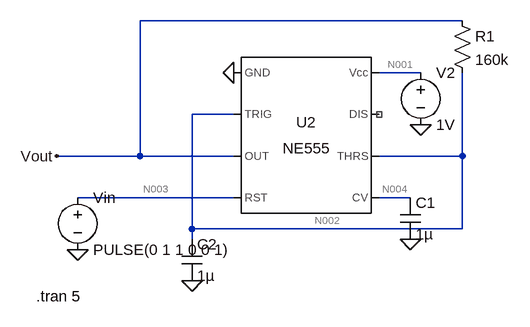
[diagram p0: schematic Oscillateur 5Hz.asc]
Oscillateur 5Hz.asc, the LTspice schematic file:
Version 4
SHEET 1 1068 680
WIRE 928 -64 432 -64
WIRE 864 16 800 16
WIRE 576 80 512 80
WIRE 432 144 432 -64
WIRE 432 144 304 144
WIRE 576 144 432 144
WIRE 928 144 928 16
WIRE 928 144 800 144
WIRE 576 208 336 208
WIRE 848 208 800 208
WIRE 512 256 512 80
WIRE 928 256 928 144
WIRE 928 256 512 256
WIRE 512 272 512 256
FLAG 576 16 0
FLAG 848 272 0
FLAG 512 336 0
FLAG 336 288 0
FLAG 864 96 0
FLAG 304 144 Vout
SYMBOL Misc\\NE555 688 112 R0
SYMATTR InstName U2
SYMBOL cap 496 272 R0
SYMATTR InstName C2
SYMATTR Value 1µ
SYMBOL cap 832 208 R0
SYMATTR InstName C1
SYMATTR Value 1µ
SYMBOL res 912 -80 R0
SYMATTR InstName R1
SYMATTR Value 160k
SYMBOL voltage 336 192 R0
WINDOW 123 0 0 Left 0
WINDOW 39 0 0 Left 0
SYMATTR InstName Vin
SYMATTR Value PULSE(0 1 1 0 0 1)
SYMBOL voltage 864 0 R0
SYMATTR InstName V2
SYMATTR Value 1V
TEXT 272 360 Left 2 !.tran 5

The netlist it stands for:
* Oscillateur 5Hz.asc
XU2 0 N002 Vout N003 N004 N002 NC_01 N001 NE555  ; pins GND TRIG OUT RST CV THRS DIS Vcc
C2 N002 0 1µ
C1 N004 0 1µ
R1 Vout N002 160k
Vin N003 0 PULSE(0 1 1 0 0 1)
V2 N001 0 1V
.tran 5
.lib NE555.sub
.backanno
.end

* Results of the author's LTspice run, read from the files saved beside the schematic
* Operating Point, zero values left out:
*   V(n002) = 5.998 µV
*   V(n004) = 666.7 mV
*   V(n001) = 1 V
*   V(vout) = 6 µV
*   I(V2) = -695.3 µA
*   I(Vin) = 377.6 µA
*   Ix(u2:1) = -317.7 µA
*   Ix(u2:4) = -377.6 µA
*   Ix(u2:8) = 695.3 µA
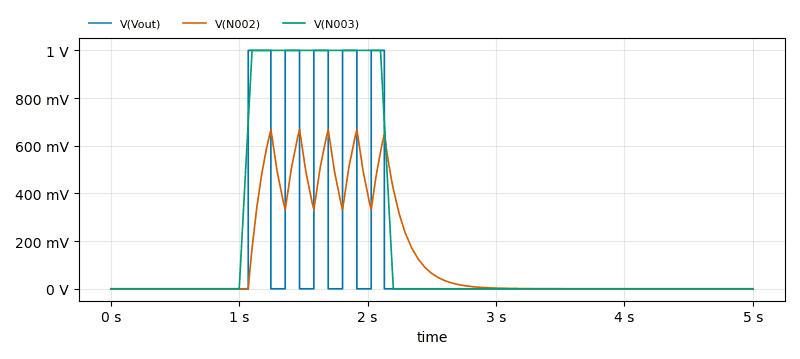
[diagram p1: Transient Analysis of Oscillateur 5Hz.asc, plotted from the saved traces]
* Transient Analysis, 1 run:
*   V(Vout): min 5.996 µV, max 1 V, average 122.7 mV, rms 350.3 mV, last 6 µV
*   V(N002): min 5.998 µV, max 667.7 mV, average 122.8 mV, rms 244.5 mV, last 6.008 µV
*   V(N003): min 0 V, max 1 V, average 220 mV, rms 461.9 mV, last 0 V